# EAGLE design codecshield (EAGLE 6.2)
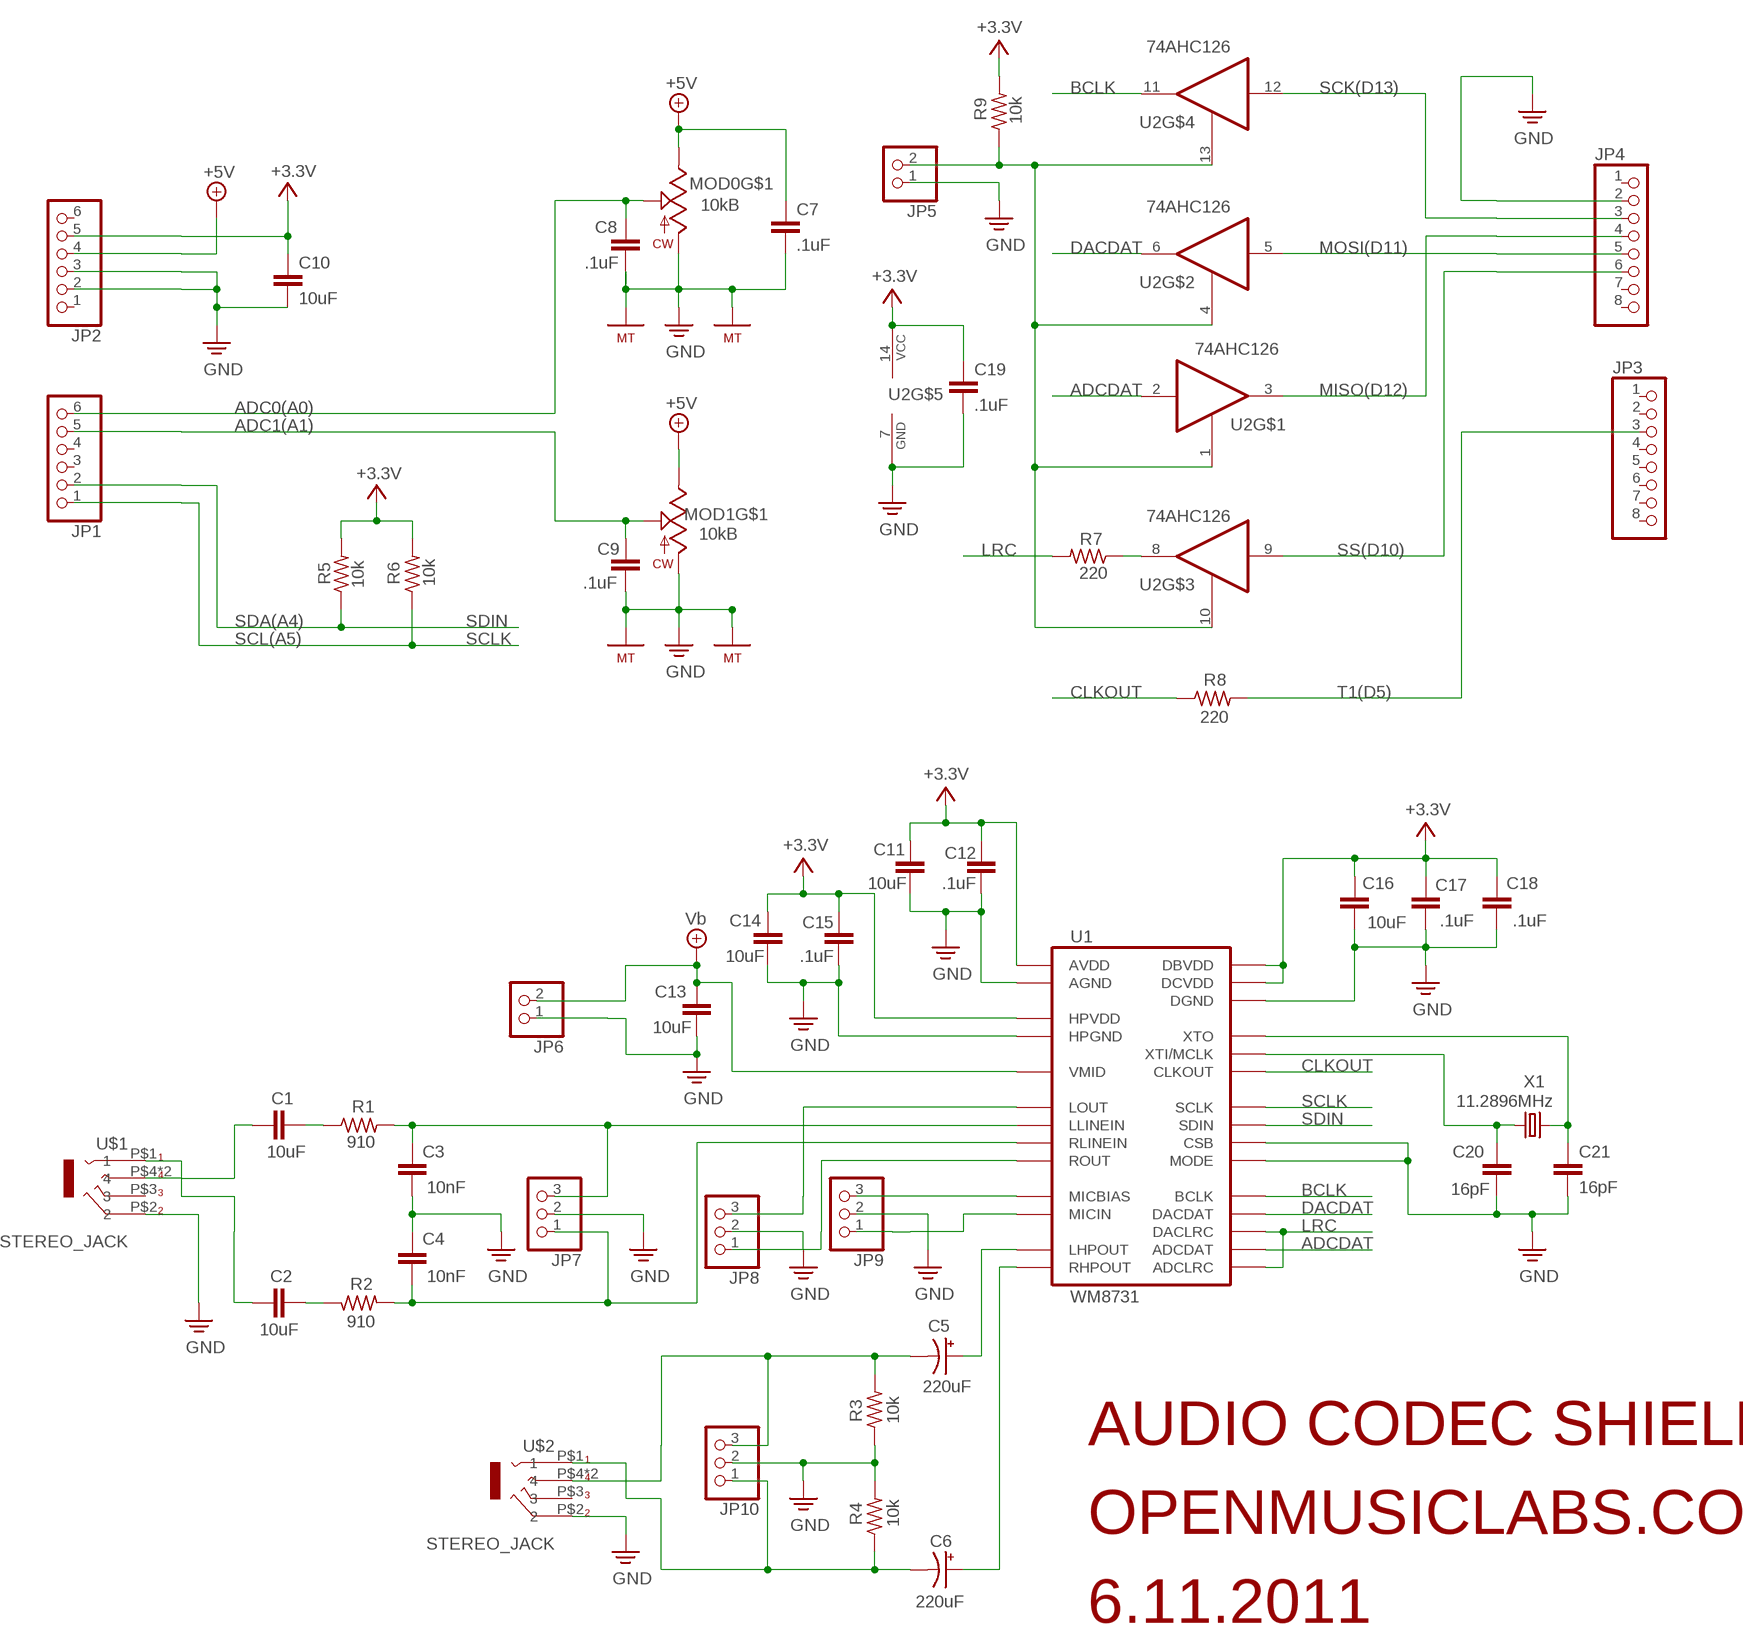
[diagram p0: schematic, sheet 1]

## Parts
C1  10uF  CAPACITOR0805  [0805A]
C2  10uF  CAPACITOR0805  [0805A]
C3  10nF  CAPACITOR0805  [0805A]
C4  10nF  CAPACITOR0805  [0805A]
C5  220uF  CAPACITOR-POL6.3MMX2.5MM  [CAP/6.3MMX2.5MM]
C6  220uF  CAPACITOR-POL6.3MMX2.5MM  [CAP/6.3MMX2.5MM]
C7  .1uF  CAPACITOR0805  [0805A]
C8  .1uF  CAPACITOR0805  [0805A]
C9  .1uF  CAPACITOR0805  [0805A]
C10  10uF  CAPACITOR0805  [0805A]
C11  10uF  CAPACITOR0805  [0805A]
C12  .1uF  CAPACITOR0805  [0805A]
C13  10uF  CAPACITOR0805  [0805A]
C14  10uF  CAPACITOR0805  [0805A]
C15  .1uF  CAPACITOR0805  [0805A]
C16  10uF  CAPACITOR0805  [0805A]
C17  .1uF  CAPACITOR0805  [0805A]
C18  .1uF  CAPACITOR0805  [0805A]
C19  .1uF  CAPACITOR0805  [0805A]
C20  16pF  CAPACITOR0805  [0805A]
C21  16pF  CAPACITOR0805  [0805A]
JP1  PINHD-1X6  [1X06]
JP2  PINHD-1X6  [1X06]
JP3  PINHD-1X8  [1X08]
JP4  PINHD-1X8  [1X08]
JP5  PINHD-1X2  [1X02]
JP6  PINHD-1X2  [1X02]
JP7  PINHD-1X3  [1X03]
JP8  PINHD-1X3  [1X03]
JP9  PINHD-1X3  [1X03]
JP10  PINHD-1X3  [1X03]
MOD0  10kB  POTALPHA/VERT  [POT/SINGLE/ALPHA/VERT]
MOD1  10kB  POTALPHA/VERT  [POT/SINGLE/ALPHA/VERT]
R1  910  RESISTOR0805  [0805A]
R2  910  RESISTOR0805  [0805A]
R3  10k  RESISTOR0805  [0805A]
R4  10k  RESISTOR0805  [0805A]
R5  10k  RESISTOR0805  [0805A]
R6  10k  RESISTOR0805  [0805A]
R7  220  RESISTOR0805  [0805A]
R8  220  RESISTOR0805  [0805A]
R9  10k  RESISTOR0805  [0805A]
U1  WM8731  [28-SSOP]
U2  74AHC126  [14-SOIC]
U$1  STEREO_JACK  [JACK_STEREO]
U$2  STEREO_JACK  [JACK_STEREO]
X1  11.2896MHz  CRYSTALHC49U/SMT  [HC49U/SMT]

## Nets
+5V: C7.+ JP2.4 MOD0.P$3 MOD1.P$3
+5V/1: C13.- JP6.2 U1.P$16(VMID) ; supply symbol labelled Vb
ADCDAT: U1.P$6(ADCDAT) U2.2(I)
BCLK: U1.P$3(BCLK) U2.11(O)
CLKOUT: R8.+ U1.P$2(CLKOUT)
DACDAT: U1.P$4(DACDAT) U2.6(O)
LINE_IN: C1.+ U$1.P$4 U$1.P$5
LRC: R7.- U1.P$5(DACLRC) U1.P$7(ADCLRC)
N$1: C5.P$1(+) U1.P$9(LHPOUT)
N$2: C6.P$1(+) U1.P$10(RHPOUT)
N$3: JP9.1 U1.P$18(MICIN)
N$4: C1.- R1.+
N$5: C5.P$2(-) JP10.3 R3.- U$2.P$4 U$2.P$5
N$6: C6.P$2(-) JP10.1 R4.+ U$2.P$1
N$7: JP8.3 U1.P$12(LOUT)
N$8: JP3.3 R8.-
N$9: JP8.1 U1.P$13(ROUT)
N$10: C3.- JP7.3 R1.- U1.P$20(LLINEIN)
N$11: JP4.6 U2.9(I)
N$14: JP4.3 U2.12(I)
N$15: JP5.2 R9.+ U2.1(OE) U2.4(OE) U2.10(OE) U2.13(OE)
N$16: C2.- U$1.P$1
N$17: C2.+ R2.+
N$19: C8.- JP1.6 MOD0.P$2
N$20: C9.+ JP1.5 MOD1.P$2
N$23: C4.- JP7.1 R2.- U1.P$19(RLINEIN)
N$35: JP9.3 U1.P$17(MICBIAS)
N$36: JP4.5 U2.5(I)
N$57: C20.+ U1.P$25(XTI/MCLK) X1.1
N$58: C21.+ U1.P$26(XTO) X1.2
N$65: JP4.4 U2.3(O)
N$67: R7.+ U2.8(O)
PE: C3.+ C4.+ C7.- C8.+ C9.- C10.- C11.+ C12.+ C13.+ C14.+ C15.+ C16.+ C17.+ C18.+ C19.- C20.- C21.- JP2.2 JP2.3 JP4.2 JP5.1 JP6.1 JP7.2 JP8.2 JP9.2 JP10.2 MOD0.P$1 MOD0.P$4(MT) MOD0.P$5(MT) MOD1.P$1 MOD1.P$4(MT) MOD1.P$5(MT) R3.+ R4.- U1.P$11(HPGND) U1.P$15(AGND) U1.P$21(MODE) U1.P$22(CSB) U1.P$28(DGND) U2.7(GND) U$1.P$2 U$2.P$2 ; supply symbol labelled GND
SCLK: JP1.1 R6.+ U1.P$24(SCLK)
SDIN: JP1.2 R5.+ U1.P$23(SDIN)
VCC: C10.+ C11.- C12.- C14.- C15.- C16.- C17.- C18.- C19.+ JP2.5 R5.- R6.- R9.- U1.P$1(DBVDD) U1.P$8(HPVDD) U1.P$14(AVDD) U1.P$27(DCVDD) U2.14(VCC) ; supply symbol labelled +3.3V
Unconnected: JP1.3 JP1.4 JP2.1 JP2.6 JP3.1 JP3.2 JP3.4 JP3.5 JP3.6 JP3.7 JP3.8 JP4.1 JP4.7 JP4.8 U$1.P$3 U$2.P$3

## Notes on the sheet
- SCK(D13)
- MOSI(D11)
- MISO(D12)
- ADC0(A0)
- ADC1(A1)
- SS(D10)
- SDA(A4)
- SCL(A5)
- T1(D5)
- AUDIO CODEC SHIELD
- OPENMUSICLABS.COM
- 6.11.2011

## Library data of the parts
C1-C4 C7-C21 = audioint:CAPACITOR
C5 C6 = audioint:CAPACITOR-POL
JP1 JP2 = pinhead:PINHD-1X6: PIN HEADER
JP3 JP4 = pinhead:PINHD-1X8: PIN HEADER
JP5 JP6 = pinhead:PINHD-1X2: PIN HEADER
JP7-JP10 = pinhead:PINHD-1X3: PIN HEADER
MOD0 MOD1 = audioint:POT
R1-R9 = audioint:RESISTOR
U1 = audioint:WM8731
U2 = audioint:74AHC126
U$1 U$2 = stero jack:STEREO_JACK
X1 = audioint:CRYSTAL

## Board
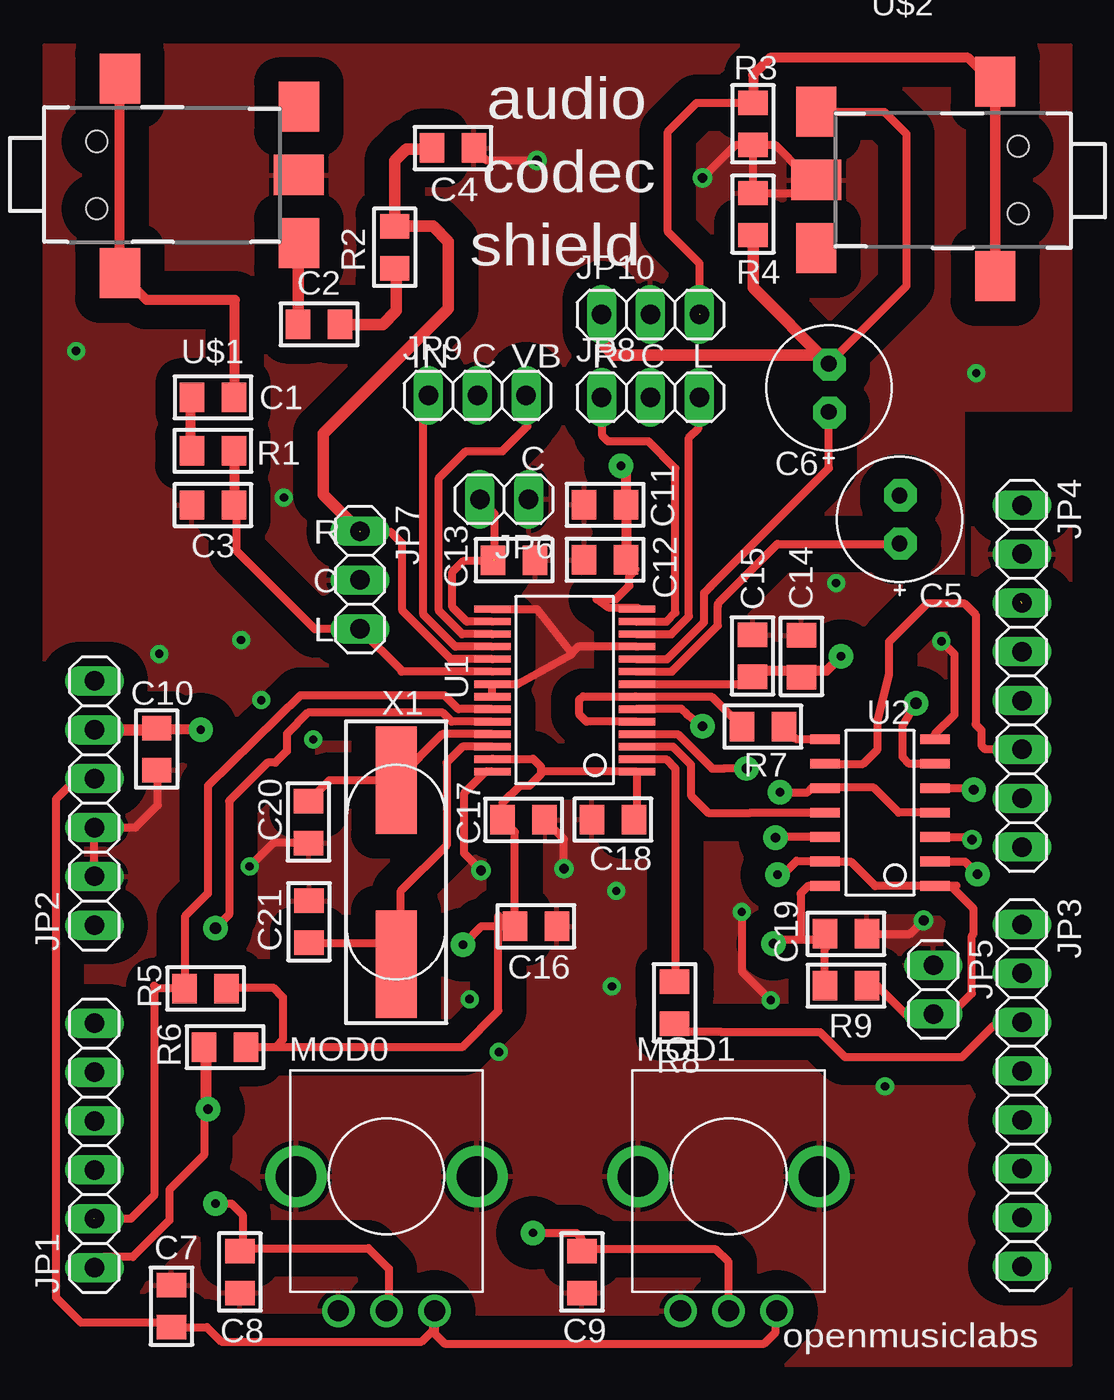
[diagram p1: board, top side]
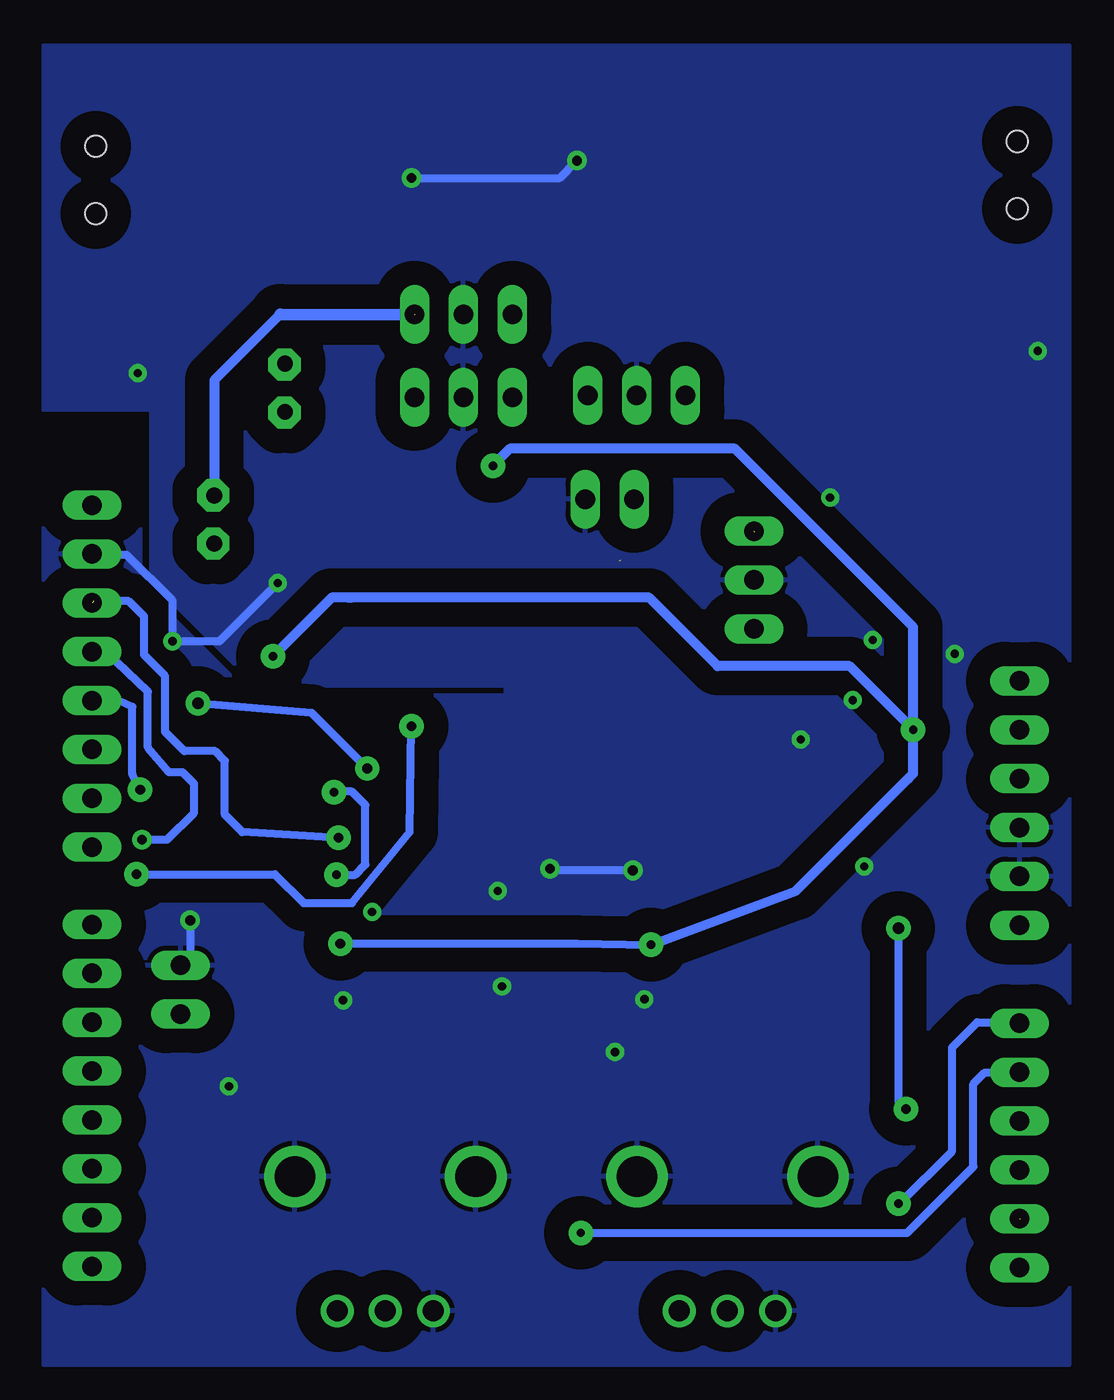
[diagram p2: board, bottom side, seen from below]

No outline drawn. Coordinates in mm, seen from the top.
Copper layers (1*16): Top 0.035mm / dielectric 1.5mm / Bottom 0.035mm
Design rules: minimum track width 8mil, minimum drill 15mil, track to track 8mil, track to pad 8mil, pad to pad 8mil, via to via 8mil, smd to smd 8mil, copper to edge 8mil, drill to drill 8mil, minimum pad ring 10mil, minimum via ring 8mil, stop-mask expansion 4mil, vias tented up to drill 0mil, thermal gap 10mil

### Footprints (pad centres in the part's own frame; a part is rotated, then mirrored left to right if it is on the bottom)
0805A = smd 1.27 x 1.524: + 1.091,0; - -1.091,0
CAP/6.3MMX2.5MM = drill 0.813 pad 1.321: P$1 1.25,0; P$2 -1.25,0
1X06 = drill 1.016 long: 1 -6.35,0; 2 -3.81,0; 3 -1.27,0; 4 1.27,0; 5 3.81,0; 6 6.35,0
1X08 = drill 1.016 long: 1 -8.89,0; 2 -6.35,0; 3 -3.81,0; 4 -1.27,0; 5 1.27,0; 6 3.81,0; 7 6.35,0; 8 8.89,0
1X02 = drill 1.016 long: 1 -1.27,0; 2 1.27,0
1X03 = drill 1.016 long: 1 -2.54,0; 2 0,0; 3 2.54,0
POT/SINGLE/ALPHA/VERT = drill 1.092 pad 1.7: P$1 2.5,0; P$2 0,0; P$3 -2.5,0 | drill 2.108 pad 3.2: P$4 -4.7,-7; P$5 4.7,-7
28-SSOP = smd 0.381 x 1.905: P$1 -4.55,-3.752; P$2 -3.9,-3.752; P$3 -3.25,-3.752; P$4 -2.6,-3.752; P$5 -1.95,-3.752; P$6 -1.3,-3.752; P$7 -0.65,-3.752; P$8 0,-3.752; P$9 0.65,-3.752; P$10 1.3,-3.752; P$11 1.95,-3.752; P$12 2.6,-3.752; P$13 3.25,-3.752; P$14 3.9,-3.752; P$15 3.9,3.752; P$16 3.25,3.752; P$17 2.6,3.752; P$18 1.95,3.752; P$19 1.3,3.752; P$20 0.65,3.752; P$21 0,3.752; P$22 -0.65,3.752; P$23 -1.3,3.752; P$24 -1.95,3.752; P$25 -2.6,3.752; P$26 -3.25,3.752; P$27 -3.9,3.752; P$28 -4.55,3.752
14-SOIC = smd 1.524 x 0.508: 1 -2.857,3.81; 2 -2.857,2.54; 3 -2.857,1.27; 4 -2.857,0; 5 -2.857,-1.27; 6 -2.857,-2.54; 7 -2.857,-3.81; 8 2.857,-3.81; 9 2.857,-2.54; 10 2.857,-1.27; 11 2.857,0; 12 2.857,1.27; 13 2.857,2.54; 14 2.857,3.81
JACK_STEREO = smd 2.6 x 2.1: P$1 -3.55,-7; P$3 3.55,-7; P$4 -5.1,2.3; P$5 5,2.3 | smd 2.1 x 2.6: P$2 0,-7 | hole 1.1: -1.75,3.5; 1.75,3.5
HC49U/SMT = smd 5.588 x 2.134: 1 -4.774,0; 2 4.774,0

### Placement (x,y rotation side)
C1  8.76,50.29 0 top
C2  14.28,54.09 0 top
C3  8.76,44.69 180 top
C4  21.24,63.25 0 top
C5  44.45,43.94 270 top
C6  40.77,50.8 270 top
C7  6.6,3.05 270 top
C8  10.16,4.83 270 top
C9  27.94,4.83 90 top
C10  5.84,32 90 top
C11  29.14,44.71 180 top
C12  29.14,41.85 180 top
C13  24.41,41.83 0 top
C14  39.34,36.83 90 top
C15  36.8,36.86 90 top
C16  25.54,22.79 0 top
C17  24.91,28.33 0 top
C18  29.55,28.34 180 top
C19  41.65,22.41 180 top
C20  13.73,28.21 90 top
C21  13.76,23.03 270 top
JP1  2.6,11.4 90 top
JP2  2.6,29.2 90 top
JP3  50.8,14 270 top
JP4  50.8,35.8 270 top
JP5  46.2,19.5 270 top
JP6  23.9,45 180 top
JP7  16.4,40.8 270 top
JP8  31.5,50.3 0 top
JP9  22.5,50.4 0 top
JP10  31.5,54.6 0 top
MOD0  17.78,2.79 180 top
MOD1  35.56,2.79 180 top
R1  8.76,47.51 180 top
R2  18.21,58.1 270 top
R3  36.83,64.52 270 top
R4  36.83,59.82 270 top
R5  8.38,19.56 180 top
R6  9.4,16.51 180 top
R7  37.34,33.17 0 top
R8  32.75,18.82 90 top
R9  41.66,19.71 0 top
U1  27.04,35.39 90 top
U2  43.43,28.71 180 top
U$1  6.22,61.85 90 top
U$2  47.12,61.59 270 top
X1  18.28,25.61 270 top

### Tracks (layer width: path | path; a pad name or v marks a point on that pad's centre or on a via)
+5V
  Top 0.254: 38.1,2.79 MOD1.P$3 | 6.6,2.03 C7.+
  Top 0.406: 1.68,30.48 1.5,30.3 | 1.5,30.3 0.6,29.4 0.6,3.5 1.9,2.2 6.36,2.2 C7.+ 8.44,1.96 9.2,1.2 19.6,1.2 20.2,1.8 20.2,2.71 MOD0.P$3 20.28,1.62 20.8,1.1 37.4,1.1 38,1.7 38,2.73 MOD1.P$3 | JP2.4 1.67,30.47 1.5,30.3
+5V/1  (1 unrouted)
  Top 0.254: C13.- 23.29,41.83
  Top 0.406: U1.P$16 21.96,38.64 21.2,39.4 21.2,41.2 21.8,41.8 23.4,41.8 23.4,44.16 23.4,44.23 JP6.2
ADCDAT  (via drill 0.5 pad 1.27)
  Top 0.406: U2.2 47.83,26.17 v48.5,25.5 | v34.2,33.2 33.4,33.8 33.1,34.1 30.8,34.1 U1.P$6
  Bottom 0.406: v48.5,25.5 41.3,25.5 39.8,24 37.3,24 34.3,27.7 v34.2,33.2
BCLK
  Top 0.406: U2.11 36.7,28.71 36.69,28.7 34.5,28.7 33.6,29.6 33.6,31.2 32.66,32.14 U1.P$3
CLKOUT
  Top 0.406: U1.P$2 32.31,31.49 32.8,31 32.8,25.6 32.8,19.96 R8.+
DACDAT  (via drill 0.5 pad 1.27, 0.6 pad 1.27)
  Top 0.254: 46.35,31.24 U2.6
  Top 0.406: U2.6 44.96,31.24 44.6,31.6 44.6,33.2 v45.3,34.4 | v36.5,31 35.29,31 34.7,31 32.91,32.79 U1.P$4
  Bottom 0.406: v45.3,34.4 39.4,33.9 v36.5,31
LINE_IN
  Top 0.508: 9.91,50.24 9.91,50.16 | C1.+ 9.91,50.24 | 9.91,50.24 9.91,55.35 5.32,55.35 U$1.P$4 U$1.P$5
LRC
  Top 0.254: 36.07,32.77 35.99,32.69 R7.- 35.91,33.17 | 30.73,34.8 U1.P$7
  Top 0.406: R7.- 34.68,34.74 U1.P$7 30.73,34.75 28,34.75 27.8,34.6 27.8,33.8 28.16,33.44 U1.P$5
N$1
  Top 0.406: U1.P$9 32.61,36.04 35,38.42 35,39.47 35.05,39.62 38.1,42.67 44.45,42.67
  Top 0.508: 44.45,42.67 C5.P$1
N$2
  Top 0.406: U1.P$10 32.37,36.69 34.29,38.61 34.29,40.13 34.8,40.64 | 34.8,40.64 34.54,40.39 | 34.8,40.64 40.77,46.61 C6.P$1
N$3
  Top 0.406: U1.P$18 21.36,37.34 19.7,39 19.7,49.93 19.7,50.14 JP9.1
N$4
  Top 0.508: 7.62,47.47 7.62,47.37 | R1.+ 7.62,47.47 | C1.- 7.62,50.24 7.62,47.47
N$5  (1 unrouted)
  Top 0.406: JP10.3 34.05,57.25 32.4,58.9 32.4,64.1 33.9,65.6 R3.-
  Top 0.508: U$2.P$4 U$2.P$5 49.42,66.53 48.01,67.94 37.72,67.94 36.83,67.06 R3.-
  Bottom 0.508: C5.P$2 44.45,51.18 41.02,54.61
  Bottom 0.61: JP10.3 41.01,54.6 41.02,54.61
N$6
  Top 0.406: U$2.P$1 43.66,65.14 44.8,64 44.8,56.08 C6.P$2
  Top 0.61: R4.+ 36.83,55.99 C6.P$2 40.32,52.5 29.6,52.5 28.96,53.14 JP10.1
  Bottom 0.508: C6.P$2 40.77,52.07
N$7
  Top 0.406: U1.P$12 32.59,37.99 33.5,38.9 33.5,48.2 34,48.7 34,50.26 JP8.3
N$8
  Top 0.406: 50.32,17.3 50.32,17.33 | 50.32,17.33 JP3.3 | R8.- 33.19,17.3 35.2,17.3 40.3,17.3 41.6,16 47.7,16 49.3,17.6 50.05,17.6 50.32,17.33
N$9
  Top 0.406: U1.P$13 32.34,38.64 32.8,39.1 32.8,46.6 31.4,48 29.3,48 29,48.3 29,50.26 JP8.1
N$10
  Top 0.406: U1.P$20 18.57,36.04 18.57,36.09 JP7.3 14.11,38.26 14.07,38.23 10,42.3 10,44.54 C3.-
  Top 0.508: 9.91,44.63 9.91,44.58 | C3.- 9.91,44.63 | R1.- 9.91,47.45 9.91,44.63
N$11
  Top 0.406: U2.9 42.55,31.25 43.3,32 43.3,33.5 43.9,35.9 43.9,37.6 45.9,39.6 47.8,39.6 48.4,39 48.4,33.3 48.7,33 48.7,32.2 48.9,32 50.79,32 JP4.6
N$12  (via drill 0.5 pad 1.68)
  other vias: 40.8,49.5
N$13  (via drill 0.5 pad 1.68)
  other vias: 40.8,52
N$14  (via drill 0.5 pad 1.27)  (1 unrouted)
  Top 0.406: U2.12 38.36,27.44 v38,27.4
  Bottom 0.406: v38,27.4 43,27.7 43.9,28.6 43.9,31.4 44.4,31.9 46,31.9 47,32.9 47,35.8 48.1,36.9 48.1,38.9 48.9,39.7 50.72,39.7
N$15  (via drill 0.43 pad 1.27)
  Top 0.254: U2.13 40.51,26.17 40.51,26.16
  Top 0.406: v38.23,29.76 39.66,29.76 39.9,30 40.55,30 U2.10 40.59,30 43.1,30 44.39,28.71 U2.4 | v38.1,25.47 38.37,25.47 39.1,26.2 40.54,26.2 U2.13 41.91,26.17 43.18,24.89 43.18,24.9 U2.1 47.1,24.9 | 47.4,24.9 47.1,24.9 | 47.1,24.9 48.3,23.7 48.3,22.4 48.2,22.3 48.2,19.3 47.13,18.23 JP5.2 46.17,18.2 44.8,18.2 43.29,19.71 R9.+
  Bottom 0.406: 38.1,29.63 v38.23,29.76 38.2,29.8 37.3,29.8 36.6,29.1 36.6,26 37.13,25.47 v38.1,25.47
N$16
  Top 0.61: C2.- 13.19,58.26 U$1.P$1
N$17
  Top 0.61: C2.+ 17.59,54.09 18.3,54.8 18.3,56.92 R2.+
N$18  (via drill 0.5 pad 1.68)
  other vias: 44.5,45.2
N$19  (via drill 0.43 pad 1.27)
  Top 0.254: C8.- 10.16,5.84
  Top 0.406: v8.89,8.38 9.72,8.38 10.3,7.8 10.3,6.06 | 10.3,6.06 C8.- | 10.3,6.06 16.84,6.06 17.9,5 17.9,2.91 MOD0.P$2
  Bottom 0.406: v8.89,8.38 8.82,8.38 6.1,11.1 6.1,16.5 4.8,17.8 2.65,17.8 JP1.6
N$20  (via drill 0.43 pad 1.27)
  Top 0.254: C9.+ 27.94,5.84 28.19,5.84
  Top 0.406: v25.4,6.86 27.64,6.86 27.9,6.6 27.9,5.96 C9.+ 28.02,6 34.9,6 35.56,5.34 MOD1.P$2
  Bottom 0.406: v25.4,6.86 8.44,6.86 5,10.3 5,14.6 4.4,15.2 JP1.5
N$21  (via drill 0.5 pad 1.68)
  other vias: 44.5,42.7
N$23  (1 unrouted)
  Top 0.406: U1.P$19 21.11,36.69 18.6,39.2 18.6,42.7 18,43.3 16.39,43.3 | JP7.1 16.35,43.34 14.48,45.21
  Top 0.61: C4.- 20.09,63.2 18.8,63.2 18.21,62.61 R2.- 20.21,59.19 21,58.4 21,54.9 14.5,48.4 14.5,45.24 JP7.1
N$35
  Top 0.406: U1.P$17 21.71,37.99 20.5,39.2 20.5,46.1 21.9,47.5 23.8,47.5 25.1,48.8 25.1,50.25 25.1,50.34 JP9.3
N$36  (via drill 0.5 pad 1.27)
  Top 0.406: U2.5 48.22,29.98 v48.3,29.9
  Bottom 0.406: v48.3,29.9 48.7,30.7 48.7,34.2 49.44,34.54 50.79,34.54 JP4.5
N$57
  Top 0.406: U1.P$25 20.68,32.79 X1.1 14.81,30.39 C20.+
N$58
  Top 0.254: 18.03,20.83 18.04,20.84 X1.2 18.53,20.84 | 18.53,20.84 18.54,20.83 | 17.43,21.94 17.64,21.73 18.53,20.84
  Top 0.406: U1.P$26 21.74,32.14 20.9,31.3 20.9,27 18.5,24.6 18.5,22.6 17.64,21.73 | C21.+ 17.43,21.94
N$65  (via drill 0.5 pad 1.02)
  Top 0.406: U2.3 48.06,27.44 v48.2,27.3
  Bottom 0.406: v48.2,27.3 46.9,27.3 45.5,28.7 45.5,30.2 46.1,30.8 46.8,30.8 47.9,32.1 47.9,35 50,37 50.73,37 JP4.4
N$67
  Top 0.406: U2.8 39.09,32.52 R7.+
PE  (via drill 0.43 pad 0.94, 0.5 pad 1.02)
  Top 0.406: U1.P$15 25.61,39.29 27.4,37 | 27.4,37 27.43,36.96 24.59,35.39 U1.P$21 U1.P$22 | U1.P$11 27.74,37.34 27.4,37 | JP2.2 JP2.3 4.73,27.93 5.9,29.1 5.9,30.86 C10.- | C20.- 11.88,27.12 v10.67,25.91 | U1.P$28 22.94,30.84 21.8,29.7 21.8,26.6 v22.7,25.7 | v27,25.8 27,27.33 C17.+ | v36.25,23.54 36.25,20.46 v37.75,18.95 | R3.+ 37.98,63.42 39.4,62 39.71,62 U$2.P$2 39.43,60.91 R4.- 36.83,63.13 37.1,63.4 35.9,63.4 v34.2,61.7 | v25.6,62.6 22.98,62.6 C4.+ | U2.7 46.28,32.78 47.3,33.8 47.3,36.93 v46.62,37.61 | C19.- 45.01,22.41 v45.7,23.1
  Bottom 0.406: v22.7,25.7 26.9,25.7 v27,25.8 | v34.2,61.7 26.5,61.7 v25.6,62.6 | JP4.2 50.75,42.1 49,42.1 46.62,39.72 v46.62,37.61 44.17,37.61 v41.15,40.64 | v45.7,23.1 45.7,21.27 JP5.1
  other vias: 29.72,24.64 10.22,37.68 29.5,19.67 23.62,16.26 22.1,19 11.27,34.55 43.69,14.48 48.43,51.55 12.45,45.09 1.65,52.7 13.97,32.51 5.97,36.96
  pour Top (isolate 1.27): 47.75,49.66 53.34,49.66 53.34,68.58 0,68.58 0,0 53.34,0 53.34,49.15 48.26,49.15 48.26,40.51 42.55,34.8 29.34,34.8 29.34,35.31 42.29,35.31 47.75,40.77
  pour Bottom (isolate 1.27): 0,68.58 53.34,68.58 53.34,49.66 47.75,49.66 47.75,40.77 42.29,35.31 29.34,35.31 29.34,34.8 42.55,34.8 48.26,40.51 48.26,49.15 53.34,49.15 53.34,0 0,0
SCLK  (via drill 0.5 pad 1.27, 0.6 pad 1.27)
  Top 0.406: U1.P$24 21.16,33.44 20.7,33.9 13.7,33.9 12.6,32.8 12.6,31.9 12,31.3 11.6,31.3 9.6,29.3 9.6,23.4 v8.9,22.7 | v8.5,13.3 8.5,16.32 R6.+ 8.31,10.91 6.5,9.1 6.5,7.5 4.6,5.6 3.06,5.6 2.6,5.14 JP1.1
  Bottom 0.406: v8.9,22.7 8.9,13.7 v8.5,13.3
SDIN  (1 unrouted)
  Top 0.406: U1.P$23 21.51,34.09 20.8,34.8 13.3,34.8 8.5,30.1 8.5,24.5 7.3,23.3 R5.+ 5.84,19.56 5.7,19.7 5.7,8.8 4.5,7.6 2.56,7.6
VCC  (via drill 0.43 pad 1.27, 0.5 pad 1.27)
  Top 0.254: C15.- 36.8,35.59 36.83,35.56 36.66,35.39 | 23.11,31.5 23.28,31.5 U1.P$27 | C18.- 30.73,28.44 30.73,28.45 | 30.73,30.78 U1.P$1 | 23.88,28.19 23.62,28.19 | 40.13,24.77 40.39,25.02 40.51,24.9 U2.14 40.64,24.89 | 30.83,39.34 30.75,39.24 U1.P$14 | C12.- 30.73,41.35 | R6.- 10.41,16.51 | 9.4,19.56 R5.- 9.53,19.61 9.53,19.68 | 40.64,22.48 C19.+ 40.25,22.1 40.64,21.71 | 40.64,19.56 40.64,19.64 R9.-
  Top 0.406: 30.83,39.34 29.36,39.34 28.7,39.8 29.7,39.8 30.4,40.5 30.4,41.01 30.73,41.35 | 40.25,22.1 39.2,22.1 | 39.2,22.1 38.1,22.1 v37.9,21.9 | 23.28,31.5 25.4,31.5 25.8,31.1 25.8,30.7 | 25.8,30.7 25.2,30.1 24.7,30.1 23.8,29.2 23.8,28.35 C17.- 24.45,27.69 C16.- | 9.53,19.61 11.89,19.61 12.4,19.1 12.4,17.2 12.4,16.91 12,16.51 | C16.- 23.6,23.34 23.6,18.4 21.71,16.51 12,16.51 | U1.P$8 36.42,35.39 C15.- | 40.64,24.89 39.69,24.89 39.3,24.5 39.3,22.2 39.2,22.1 | R9.- 40.57,21.64 40.64,21.71 | 12,16.51 R6.- | C16.- 22.72,22.79 v21.76,21.84 | C18.- 30.79,28.5 U1.P$1 25.94,30.84 25.8,30.7
  Top 0.508: 23.88,28.39 23.88,28.45 | 23.88,28.39 C17.- | 23.88,28.19 23.88,28.39 | C14.- 39.34,35.71 39.37,35.69 39.24,35.56 39.37,35.56 | C12.- 30.23,41.9 30.23,41.91 30.23,41.92 C11.- | 39.37,35.56 39.5,35.56 | C11.- | C11.- 30.23,44.58 | C10.+ 5.84,33.02 v8.13,33.02 | 39.37,35.56 39.37,36.07 39.31,36.01 | C15.- 36.83,35.79 36.83,36.07 38.86,36.07 39.12,35.81 | 39.12,35.81 39.37,35.56 | 39.31,36.01 39.12,35.81 | 39.31,36.01 39.24,36.07 40.64,36.07 v41.4,36.83 | C11.- | v29.97,46.74 30.23,46.48 C11.-
  Top 0.61: JP2.5 5.76,33.01 C10.+
  Bottom 0.406: v37.9,21.9 25.6,21.9 v21.76,21.84
  Bottom 0.508: v21.76,21.84 14.22,24.64 8.64,30.23 | 8.64,30.23 8.38,30.48 | v8.13,33.02 8.13,30.73 8.64,30.23 | v8.13,33.02 8.13,35.31 | 8.13,35.31 8.13,35.56 | v29.97,46.74 29.08,47.62 17.4,47.62 8.13,38.35 8.13,35.31 | 37.34,39.88 21.84,39.88 18.29,36.32 11.43,36.32 v8.13,33.02 | 37.34,39.88 37.47,39.88 | v41.4,36.83 38.35,39.88 37.34,39.88

### Text on the board
tNames: audio | codec | shield | IN | C | VB | R | C | L | C | R | C | L | openmusiclabs